# EAGLE design Turn-On-Test (EAGLE 7.7.0)
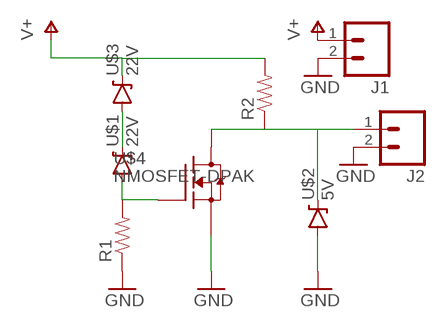
[diagram p0: schematic, sheet 1]

## Parts
J1  M02PTH  [1X02]
J2  M02PTH  [1X02]
R1  RESISTOR0603-RES  [0603-RES]
R2  RESISTOR0603-RES  [0603-RES]
U$1  22V  ZENER-SOT23  [SOT23-3]
U$2  5V  ZENER-SOT23  [SOT23-3]
U$3  22V  ZENER-SOT23  [SOT23-3]
U$4  NMOSFET-DPAK  [DPAK]

## Nets
GND: J1.2 J2.2 R1.1 U$2.1(A) U$4.3(S)
N$1: U$1.3(C) U$3.1(A)
N$2: R1.2 U$1.1(A) U$4.1(G)
N$3: J2.1 R2.1 U$2.3(C) U$4.4(D1)
V+: J1.1 R2.2 U$3.3(C)

## Library data of the parts
J1 J2 = SparkFun-Connectors:M02: Standard 2-pin 0.1" header. Use with - straight break away headers ( PRT-00116) - right angle break away headers (PRT-00553) - swiss pins (PRT-00743) - machine pins (PRT-00117) - female headers (PRT-00115) Molex polarized connector foot print use with: PRT-08233 with associated crimp pins and housings. 2.54_SCREWTERM for use with PRT-10571. 3.5mm Screw Terminal footprints for PRT-08084 5mm Screw Terminal footprints for use with PRT-08432
R1 R2 = SparkFun-Passives:RESISTOR: Resistor Basic schematic elements and footprints for 0603, 1206, and PTH resistors.
U$1 U$3 = MotherboardParts:ZENER-SOT23; PN-DIGI: BZX84C22LT1GOSCT-ND
U$2 = MotherboardParts:ZENER-SOT23
U$4 = MotherboardParts:NMOSFET-DPAK; PN-DIGI: 497-4329-1-ND; VDSS: 60V

## Board
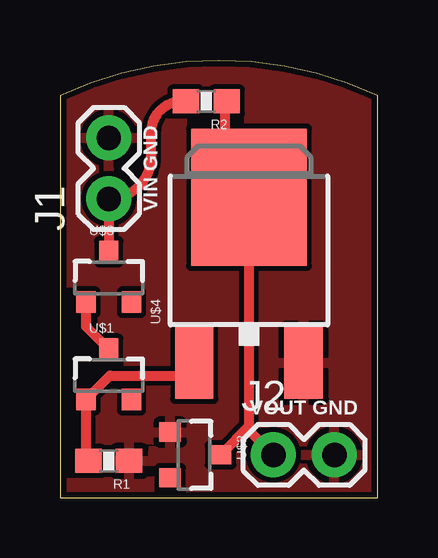
[diagram p1: board, top side]
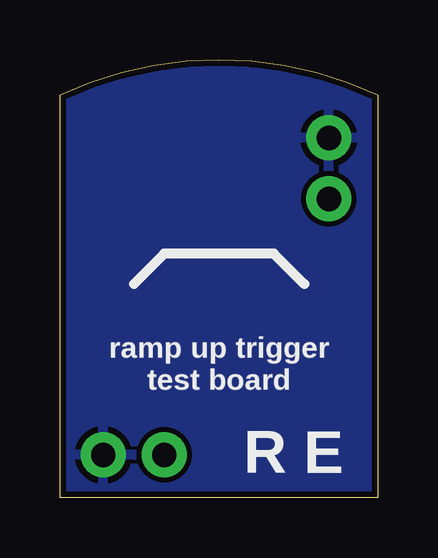
[diagram p2: board, bottom side, seen from below]

Size 13.23 x 18.23 mm. Coordinates in mm from the lower left corner, seen from the top.
Outline: 0,0 13.23,0 13.23,16.76 arc50 0,16.76 0,0
Copper layers (1*16): Top 0.035mm / dielectric 1.5mm / Bottom 0.035mm
Design rules "default *": minimum track width 10mil, minimum drill 24mil, track to track 8mil, track to pad 8mil, pad to pad 8mil, via to via 8mil, smd to smd 8mil, copper to edge 10mil, drill to drill 8mil, minimum pad ring 10mil, minimum via ring 8mil, stop-mask expansion 4mil, vias tented up to drill 0mil, thermal gap 10mil

### Footprints (pad centres in the part's own frame; a part is rotated, then mirrored left to right if it is on the bottom)
1X02 = drill 1.016 pad 1.88: 1 0,0; 2 2.54,0
0603-RES = smd 1.1 x 1: 1 -0.85,0; 2 0.85,0
SOT23-3 = smd 0.8 x 0.9: 1 -0.95,-1; 2 0.95,-1; 3 0,1.1
DPAK = smd 1.6 x 3: 1 -2.28,-5.31; 3 2.28,-5.31 | smd 4.826 x 5.715: 4 0,1.588

### Placement (x,y rotation side)
J1  2.03,12.45 90 top
J2  8.89,1.78 0 top
R1  2.03,1.52 180 top
R2  6.1,16.51 180 top
U$1  2.03,5.08 0 top
U$2  5.59,1.78 270 top
U$3  2.03,9.14 0 top
U$4  7.87,10.92 0 top

### Tracks (layer width: path | path; a pad name or v marks a point on that pad's centre or on a via)
GND
  pour Top: 0,20.32 0,0 13.21,0 13.21,20.32
  pour Bottom: 0,20.57 0,0 13.21,0 13.21,20.57
N$1
  Top 0.406: U$3.1 1.08,7.13 U$1.3
N$2
  Top 0.406: R1.2 1.08,1.62 U$1.1 2.08,5.08 5.59,5.08 5.59,5.09 U$4.1
N$3
  Top 0.406: R2.1 6.86,16.76 6.86,12.45 7.87,12.45 U$4.4 7.87,2.96 | 7.87,2.96 U$2.3 | 7.87,2.96 7.87,2.79 J2.1
V+
  Top 0.406: 5.25,16.68 R2.2 5.08,16.51 arc90 3.81,15.24 3.81,14.22 arc-90 J1.1 U$3.3

### Text on the board
tPlace: VIN GND | VOUT GND
bPlace: ramp up trigger / test board | R E
bStop: H